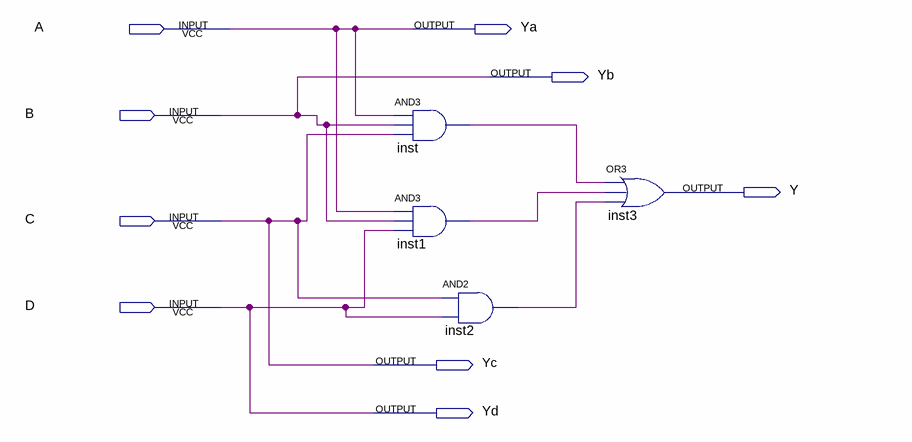
[diagram p0: schematic sheet]
// Quartus schematic Block2.bdf as structural Verilog: 4 symbols, 9 pins
module Block2 (
  input  A,
  input  B,
  input  C,
  input  D,
  output Ya,
  output Yb,
  output Y,
  output Yc,
  output Yd
);

  wire inst1_out, inst2_out, inst_out;

  and inst (inst_out, A, B, C);
  and inst1 (inst1_out, A, B, D);
  and inst2 (inst2_out, C, D);
  or inst3 (Y, inst_out, inst1_out, inst2_out);

  assign Ya = A;
  assign Yb = B;
  assign Yc = C;
  assign Yd = D;
endmodule
